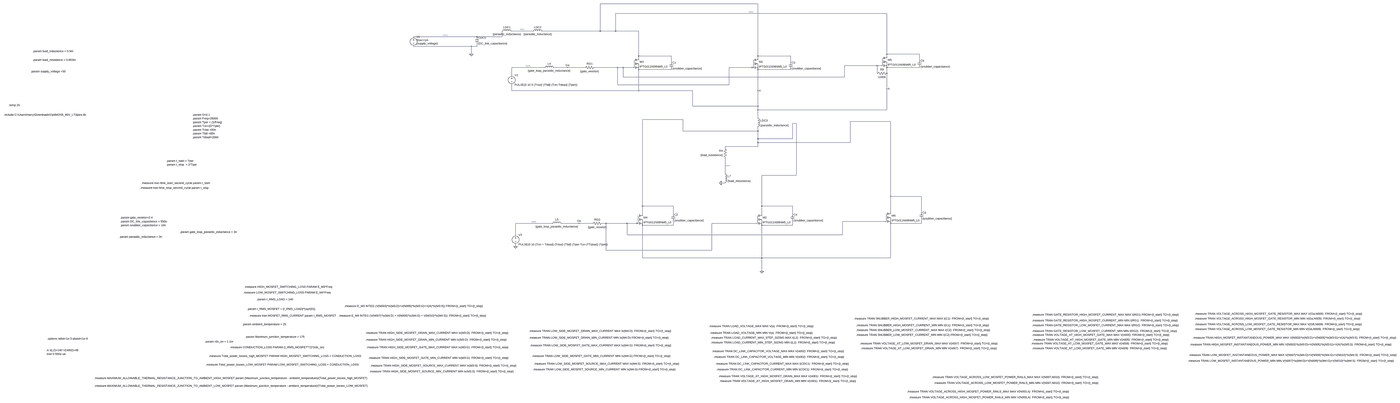
[diagram p0: schematic LTspice_simulation_ready_140A_load_steady_state.asc, whole sheet]
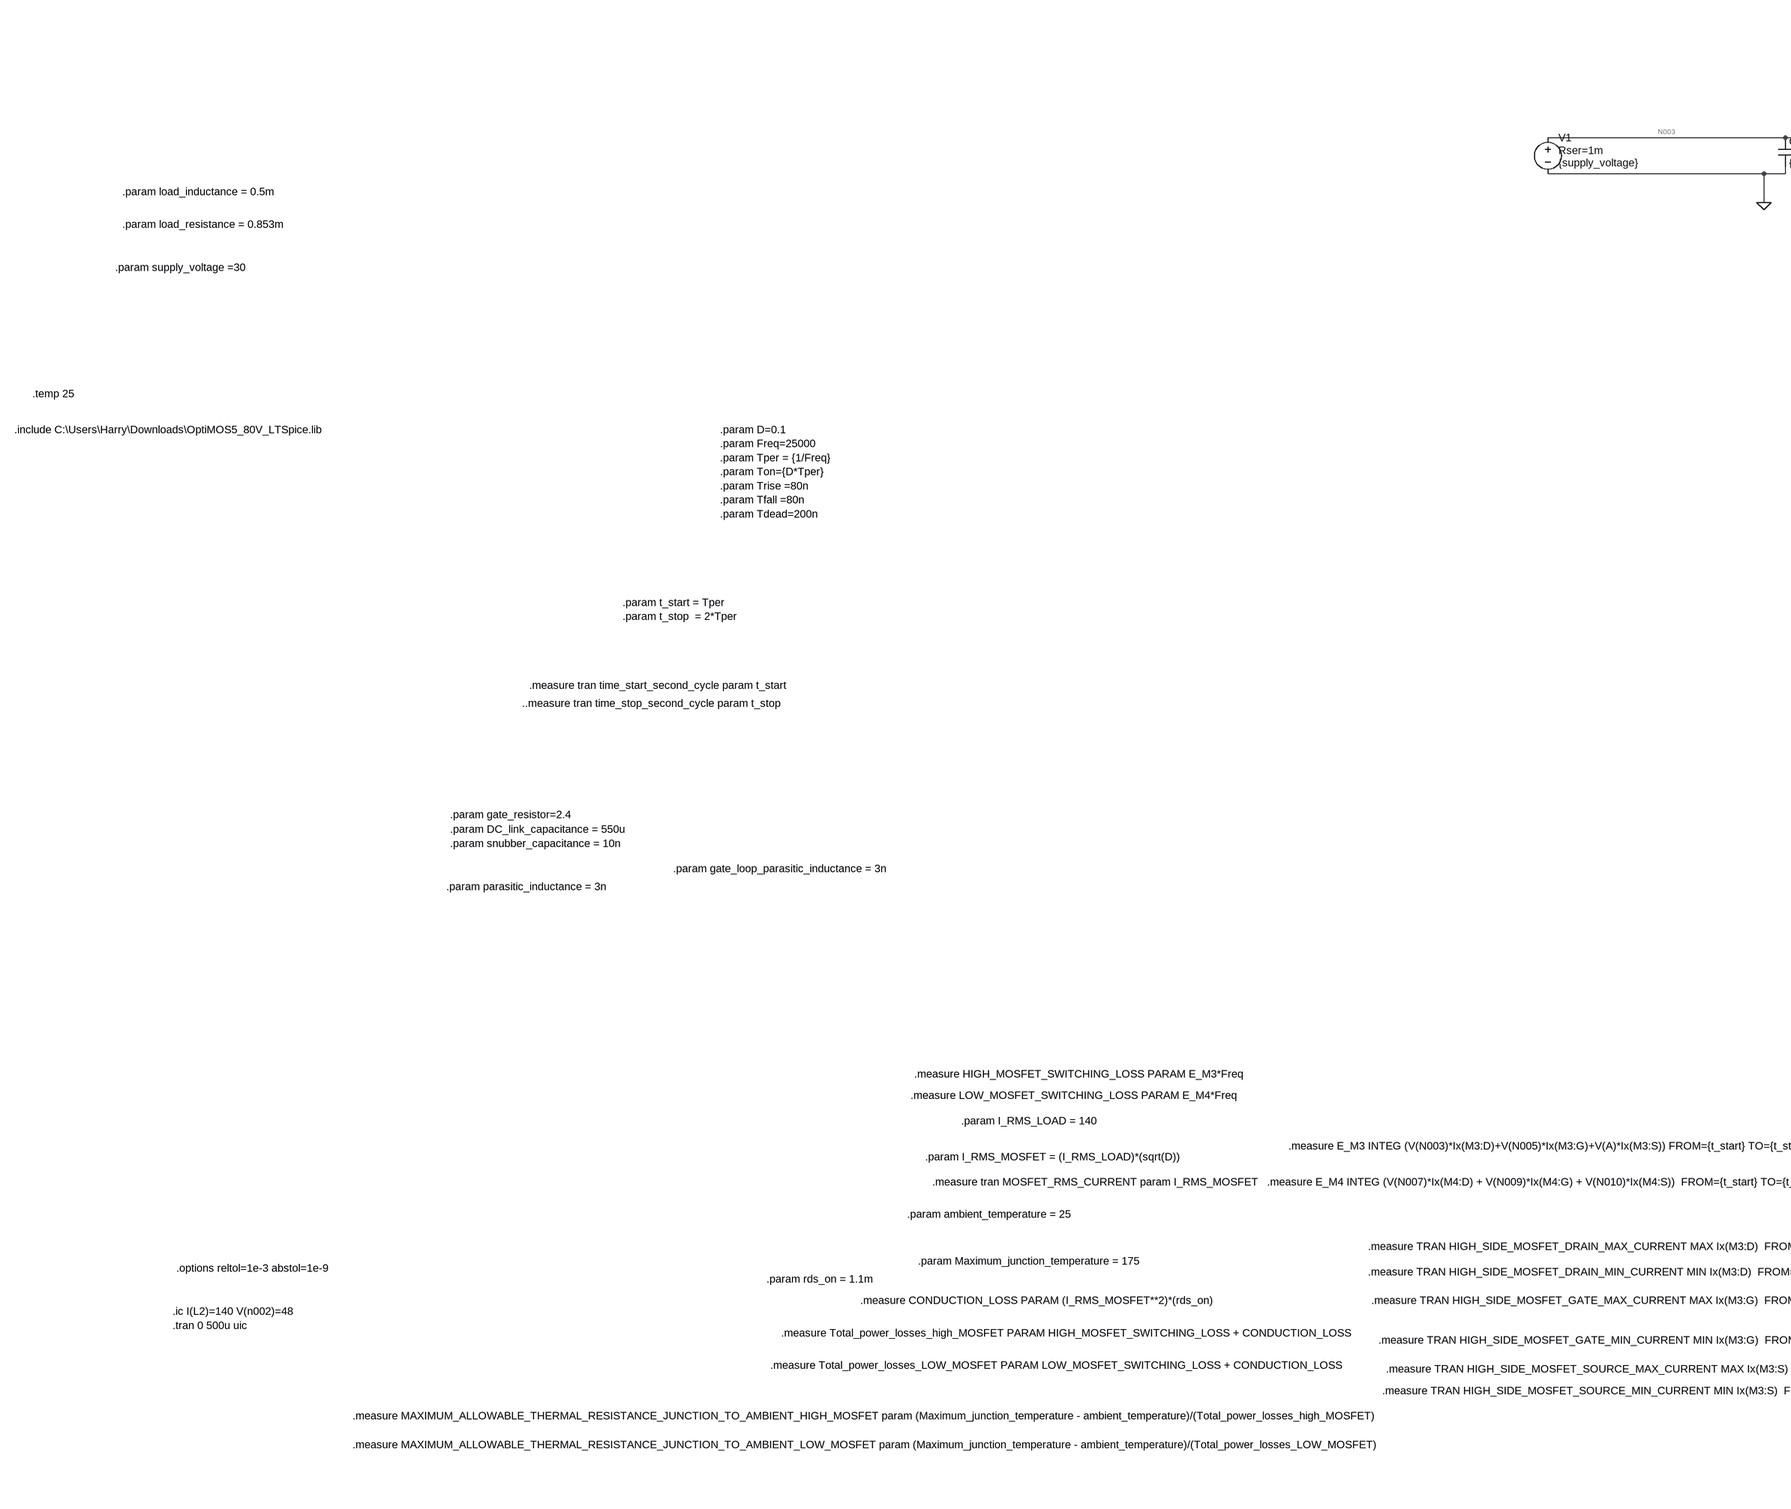
[diagram p1: schematic LTspice_simulation_ready_140A_load_steady_state.asc, part, row 1 of 1, column 1 of 3]
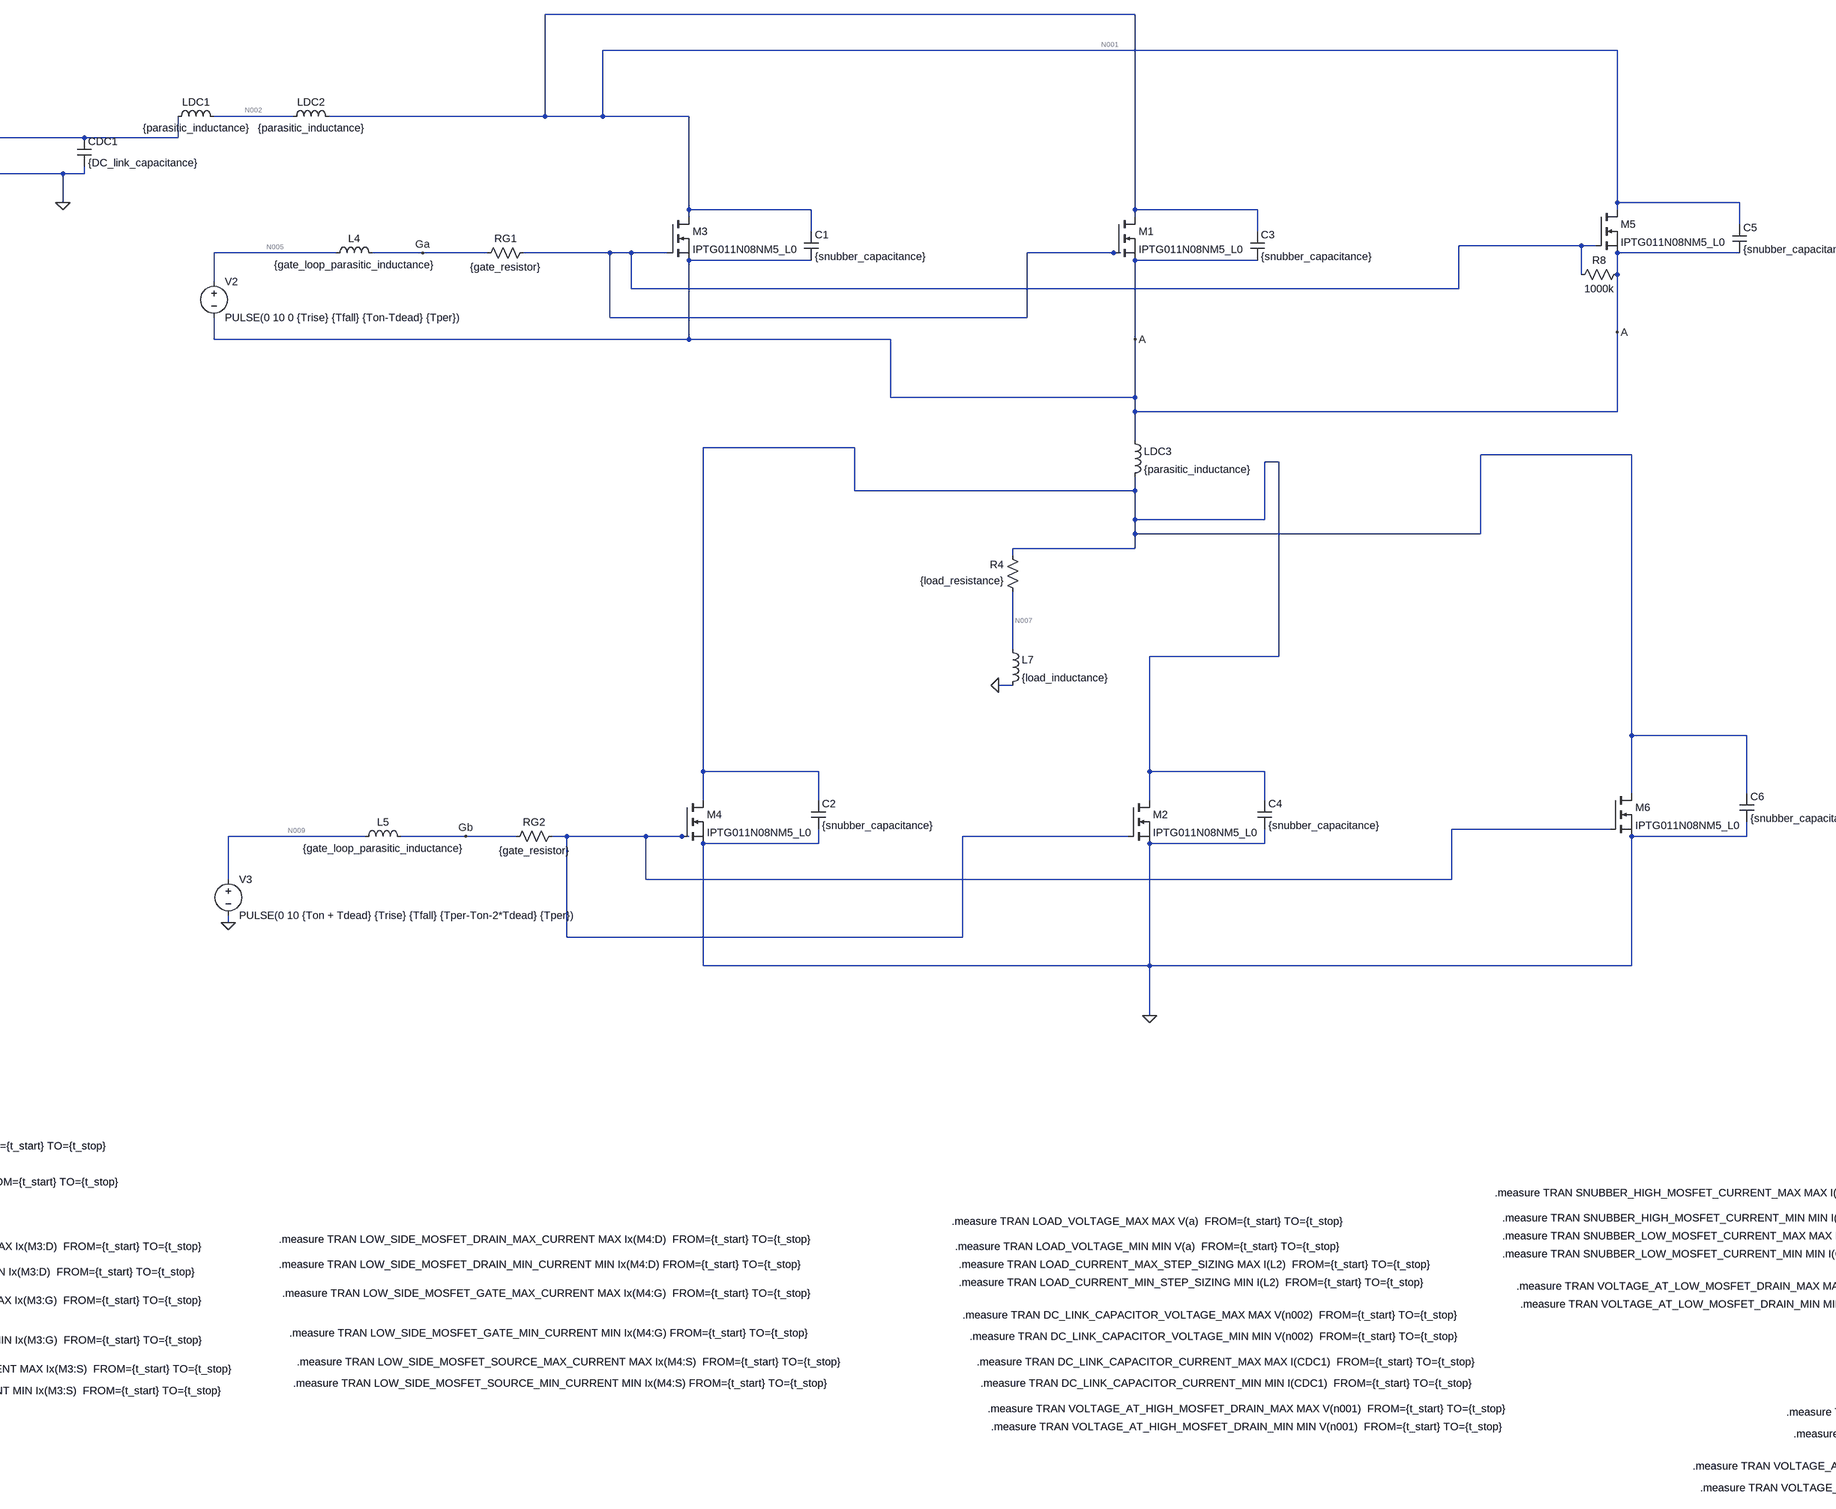
[diagram p2: schematic LTspice_simulation_ready_140A_load_steady_state.asc, part, row 1 of 1, column 2 of 3]
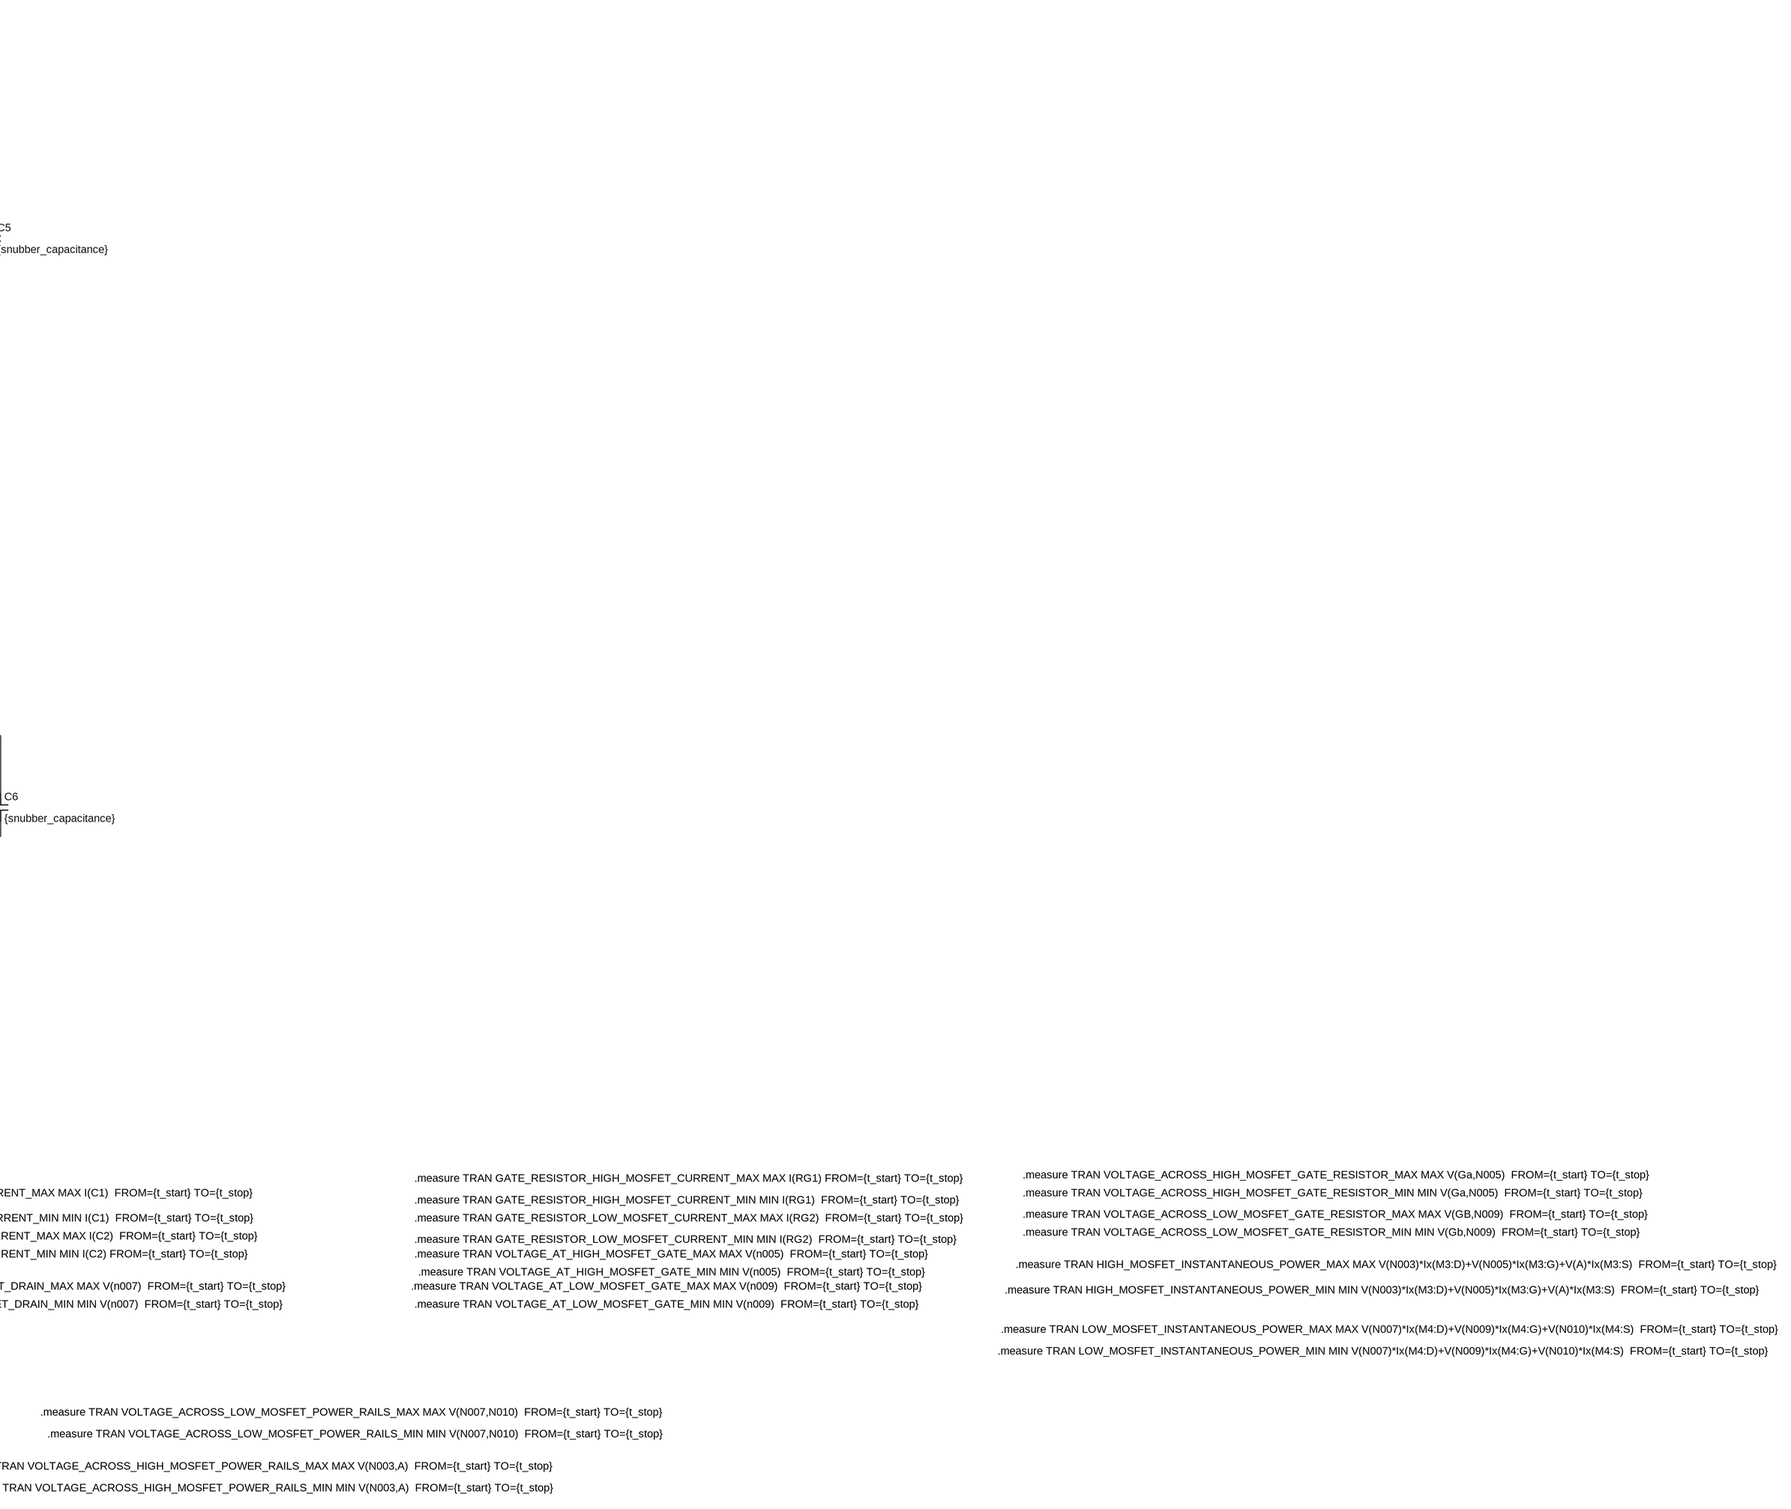
[diagram p3: schematic LTspice_simulation_ready_140A_load_steady_state.asc, part, row 1 of 1, column 3 of 3]
LTspice_simulation_ready_140A_load_steady_state.asc, the LTspice schematic file:
Version 4.1
SHEET 1 7924 1472
WIRE 2480 -2208 1168 -2208
WIRE 3552 -2128 1296 -2128
WIRE 608 -1920 432 -1920
WIRE 1168 -1920 1168 -2208
WIRE 1168 -1920 688 -1920
WIRE 1296 -1920 1296 -2128
WIRE 1296 -1920 1168 -1920
WIRE 1488 -1920 1296 -1920
WIRE 144 -1872 -384 -1872
WIRE 352 -1872 352 -1920
WIRE 352 -1872 144 -1872
WIRE 96 -1792 -384 -1792
WIRE 144 -1792 144 -1808
WIRE 144 -1792 96 -1792
WIRE 96 -1728 96 -1792
WIRE 3552 -1728 3552 -2128
WIRE 3824 -1728 3552 -1728
WIRE 1488 -1712 1488 -1920
WIRE 1760 -1712 1488 -1712
WIRE 2480 -1712 2480 -2208
WIRE 2752 -1712 2480 -1712
WIRE 3552 -1712 3552 -1728
WIRE 1488 -1696 1488 -1712
WIRE 2480 -1696 2480 -1712
WIRE 3824 -1680 3824 -1728
WIRE 1760 -1664 1760 -1712
WIRE 2752 -1664 2752 -1712
WIRE 3472 -1632 3200 -1632
WIRE 3504 -1632 3472 -1632
WIRE 704 -1616 432 -1616
WIRE 896 -1616 784 -1616
WIRE 1040 -1616 896 -1616
WIRE 1312 -1616 1120 -1616
WIRE 1360 -1616 1312 -1616
WIRE 1440 -1616 1360 -1616
WIRE 2432 -1616 2240 -1616
WIRE 2448 -1616 2432 -1616
WIRE 3824 -1616 3552 -1616
WIRE 1760 -1600 1488 -1600
WIRE 2752 -1600 2480 -1600
WIRE 3472 -1568 3472 -1632
WIRE 3552 -1568 3552 -1616
WIRE 432 -1552 432 -1616
WIRE 1360 -1536 1360 -1616
WIRE 3200 -1536 3200 -1632
WIRE 3200 -1536 1360 -1536
WIRE 1312 -1472 1312 -1616
WIRE 2240 -1472 2240 -1616
WIRE 2240 -1472 1312 -1472
WIRE 3552 -1440 3552 -1568
WIRE 432 -1424 432 -1472
WIRE 1488 -1424 1488 -1600
WIRE 1488 -1424 432 -1424
WIRE 1936 -1424 1488 -1424
WIRE 2480 -1424 2480 -1600
WIRE 1936 -1200 1936 -1424
WIRE 2480 -1200 2480 -1424
WIRE 2480 -1200 1936 -1200
WIRE 2480 -1168 2480 -1200
WIRE 3552 -1168 3552 -1440
WIRE 3552 -1168 2480 -1168
WIRE 2480 -1104 2480 -1168
WIRE 1856 -1088 1520 -1088
WIRE 3584 -1072 3248 -1072
WIRE 2800 -1056 2768 -1056
WIRE 1856 -992 1856 -1088
WIRE 2480 -992 2480 -1024
WIRE 2480 -992 1856 -992
WIRE 2480 -928 2480 -992
WIRE 2768 -928 2768 -1056
WIRE 2768 -928 2480 -928
WIRE 2480 -896 2480 -928
WIRE 3248 -896 3248 -1072
WIRE 3248 -896 2480 -896
WIRE 2480 -864 2480 -896
WIRE 2480 -864 2208 -864
WIRE 2208 -848 2208 -864
WIRE 2208 -640 2208 -768
WIRE 2800 -624 2800 -1056
WIRE 2800 -624 2512 -624
WIRE 2208 -560 2176 -560
WIRE 3584 -448 3584 -1072
WIRE 3840 -448 3584 -448
WIRE 1520 -368 1520 -1088
WIRE 1776 -368 1520 -368
WIRE 2512 -368 2512 -624
WIRE 2768 -368 2512 -368
WIRE 3584 -320 3584 -448
WIRE 3840 -320 3840 -448
WIRE 1520 -304 1520 -368
WIRE 1776 -304 1776 -368
WIRE 2512 -304 2512 -368
WIRE 2768 -304 2768 -368
WIRE 3536 -240 3184 -240
WIRE 768 -224 464 -224
WIRE 992 -224 848 -224
WIRE 1104 -224 992 -224
WIRE 1216 -224 1184 -224
WIRE 1392 -224 1216 -224
WIRE 1472 -224 1392 -224
WIRE 1488 -224 1472 -224
WIRE 2464 -224 2096 -224
WIRE 3840 -224 3840 -256
WIRE 3840 -224 3584 -224
WIRE 1776 -208 1776 -240
WIRE 1776 -208 1520 -208
WIRE 2512 -208 2512 -224
WIRE 2768 -208 2768 -240
WIRE 2768 -208 2512 -208
WIRE 464 -128 464 -224
WIRE 1392 -128 1392 -224
WIRE 3184 -128 3184 -240
WIRE 3184 -128 1392 -128
WIRE 464 -32 464 -48
WIRE 1216 0 1216 -224
WIRE 2096 0 2096 -224
WIRE 2096 0 1216 0
WIRE 1520 64 1520 -208
WIRE 2512 64 2512 -208
WIRE 2512 64 1520 64
WIRE 3584 64 3584 -224
WIRE 3584 64 2512 64
WIRE 2512 256 2512 64
FLAG 896 -1616 Ga
FLAG 992 -224 Gb
FLAG 96 -1728 0
FLAG 464 -32 0
FLAG 2176 -560 0
FLAG 2480 -1424 A
FLAG 3552 -1440 A
FLAG 2512 256 0
SYMBOL voltage -384 -1888 R0
WINDOW 123 0 0 Left 0
WINDOW 39 24 44 Left 2
WINDOW 3 24 72 Left 2
SYMATTR SpiceLine Rser=1m
SYMATTR Value {supply_voltage}
SYMATTR InstName V1
SYMBOL cap 128 -1872 R0
SYMATTR InstName CDC1
SYMATTR Value {DC_link_capacitance}
SYMATTR SpiceLine Rser=1m
SYMBOL ind 336 -1904 R270
WINDOW 0 32 56 VTop 2
WINDOW 3 5 56 VBottom 2
SYMATTR InstName LDC1
SYMATTR Value {parasitic_inductance}
SYMATTR SpiceLine Rser=1m
SYMBOL res 1136 -1632 R90
WINDOW 0 0 56 VBottom 2
WINDOW 3 32 56 VTop 2
SYMATTR InstName RG1
SYMATTR Value {gate_resistor}
SYMBOL res 1200 -240 R90
WINDOW 0 0 56 VBottom 2
WINDOW 3 32 56 VTop 2
SYMATTR InstName RG2
SYMATTR Value {gate_resistor}
SYMBOL voltage 432 -1568 R0
WINDOW 123 0 0 Left 0
WINDOW 39 0 0 Left 0
SYMATTR InstName V2
SYMATTR Value PULSE(0 10 0 {Trise} {Tfall} {Ton-Tdead} {Tper})
SYMBOL voltage 464 -144 R0
WINDOW 123 0 0 Left 0
WINDOW 39 0 0 Left 0
SYMATTR InstName V3
SYMATTR Value PULSE(0 10 {Ton + Tdead} {Trise} {Tfall} {Tper-Ton-2*Tdead} {Tper})
SYMBOL ind 688 -1600 R270
WINDOW 0 32 56 VTop 2
WINDOW 3 5 56 VBottom 2
SYMATTR InstName L4
SYMATTR Value {gate_loop_parasitic_inductance}
SYMATTR SpiceLine Rser=1m
SYMBOL ind 752 -208 R270
WINDOW 0 32 56 VTop 2
WINDOW 3 5 56 VBottom 2
SYMATTR InstName L5
SYMATTR Value {gate_loop_parasitic_inductance}
SYMATTR SpiceLine Rser=1m
SYMBOL cap 1744 -1664 R0
SYMATTR InstName C1
SYMATTR Value {snubber_capacitance}
SYMBOL cap 1760 -304 R0
SYMATTR InstName C2
SYMATTR Value {snubber_capacitance}
SYMBOL nmos 1440 -1696 R0
SYMATTR InstName M3
SYMATTR Value IPTG011N08NM5_L0
SYMATTR Prefix X
SYMBOL nmos 1472 -304 R0
SYMATTR InstName M4
SYMATTR Value IPTG011N08NM5_L0
SYMATTR Prefix X
SYMBOL res 2224 -752 R180
WINDOW 0 36 76 Left 2
WINDOW 3 36 40 Left 2
SYMATTR InstName R4
SYMATTR Value {load_resistance}
SYMBOL ind 2192 -656 R0
SYMATTR InstName L7
SYMATTR Value {load_inductance}
SYMATTR SpiceLine Rser=1m
SYMBOL cap 2736 -1664 R0
SYMATTR InstName C3
SYMATTR Value {snubber_capacitance}
SYMBOL cap 2752 -304 R0
SYMATTR InstName C4
SYMATTR Value {snubber_capacitance}
SYMBOL nmos 2432 -1696 R0
SYMATTR InstName M1
SYMATTR Value IPTG011N08NM5_L0
SYMATTR Prefix X
SYMBOL nmos 2464 -304 R0
SYMATTR InstName M2
SYMATTR Value IPTG011N08NM5_L0
SYMATTR Prefix X
SYMBOL res 3568 -1584 R90
WINDOW 0 0 56 VBottom 2
WINDOW 3 32 56 VTop 2
SYMATTR InstName R8
SYMATTR Value 1000k
SYMBOL cap 3808 -1680 R0
SYMATTR InstName C5
SYMATTR Value {snubber_capacitance}
SYMBOL cap 3824 -320 R0
SYMATTR InstName C6
SYMATTR Value {snubber_capacitance}
SYMBOL nmos 3504 -1712 R0
SYMATTR InstName M5
SYMATTR Value IPTG011N08NM5_L0
SYMATTR Prefix X
SYMBOL nmos 3536 -320 R0
SYMATTR InstName M6
SYMATTR Value IPTG011N08NM5_L0
SYMATTR Prefix X
SYMBOL ind 592 -1904 R270
WINDOW 0 32 56 VTop 2
WINDOW 3 5 56 VBottom 2
SYMATTR InstName LDC2
SYMATTR Value {parasitic_inductance}
SYMATTR SpiceLine Rser=1m
SYMBOL ind 2464 -1120 R0
SYMATTR InstName LDC3
SYMATTR Value {parasitic_inductance}
SYMATTR SpiceLine Rser=1m
TEXT -2224 -1128 Left 2 !.param D=0.1\n.param Freq=25000\n.param Tper = {1/Freq}\n.param Ton={D*Tper}\n.param Trise =80n\n.param Tfall =80n\n.param Tdead=200n
TEXT -3432 968 Left 2 !.options reltol=1e-3 abstol=1e-9
TEXT -3792 -1128 Left 2 !.include C:\\Users\\Harry\\Downloads\\OptiMOS5_80V_LTSpice.lib
TEXT -3752 -1208 Left 2 !.temp 25
TEXT -2824 -208 Left 2 !.param snubber_capacitance = 10n
TEXT -2824 -240 Left 2 !.param DC_link_capacitance = 550u
TEXT -2824 -272 Left 2 !.param gate_resistor=2.4
TEXT -3568 -1584 Left 2 !.param supply_voltage =30
TEXT -3552 -1680 Left 2 !.param load_resistance = 0.853m
TEXT -3552 -1752 Left 2 !.param load_inductance = 0.5m
TEXT -2832 -112 Left 2 !.param parasitic_inductance = 3n
TEXT -960 696 Left 2 !.measure E_M3 INTEG (V(N003)*Ix(M3:D)+V(N005)*Ix(M3:G)+V(A)*Ix(M3:S)) FROM={t_start} TO={t_stop}
TEXT -1008 776 Left 2 !.measure E_M4 INTEG (V(N007)*Ix(M4:D) + V(N009)*Ix(M4:G) + V(N010)*Ix(M4:S))  FROM={t_start} TO={t_stop}
TEXT -784 920 Left 2 !.measure TRAN HIGH_SIDE_MOSFET_DRAIN_MAX_CURRENT MAX Ix(M3:D)  FROM={t_start} TO={t_stop}
TEXT -784 976 Left 2 !.measure TRAN HIGH_SIDE_MOSFET_DRAIN_MIN_CURRENT MIN Ix(M3:D)  FROM={t_start} TO={t_stop}
TEXT -776 1040 Left 2 !.measure TRAN HIGH_SIDE_MOSFET_GATE_MAX_CURRENT MAX Ix(M3:G)  FROM={t_start} TO={t_stop}
TEXT -760 1128 Left 2 !.measure TRAN HIGH_SIDE_MOSFET_GATE_MIN_CURRENT MIN Ix(M3:G)  FROM={t_start} TO={t_stop}
TEXT -752 1240 Left 2 !.measure TRAN HIGH_SIDE_MOSFET_SOURCE_MIN_CURRENT MIN Ix(M3:S)  FROM={t_start} TO={t_stop}
TEXT -744 1192 Left 2 !.measure TRAN HIGH_SIDE_MOSFET_SOURCE_MAX_CURRENT MAX Ix(M3:S)  FROM={t_start} TO={t_stop}
TEXT 576 904 Left 2 !.measure TRAN LOW_SIDE_MOSFET_DRAIN_MAX_CURRENT MAX Ix(M4:D)  FROM={t_start} TO={t_stop}
TEXT 576 960 Left 2 !.measure TRAN LOW_SIDE_MOSFET_DRAIN_MIN_CURRENT MIN Ix(M4:D) FROM={t_start} TO={t_stop}
TEXT 584 1024 Left 2 !.measure TRAN LOW_SIDE_MOSFET_GATE_MAX_CURRENT MAX Ix(M4:G)  FROM={t_start} TO={t_stop}
TEXT 600 1112 Left 2 !.measure TRAN LOW_SIDE_MOSFET_GATE_MIN_CURRENT MIN Ix(M4:G) FROM={t_start} TO={t_stop}
TEXT 608 1224 Left 2 !.measure TRAN LOW_SIDE_MOSFET_SOURCE_MIN_CURRENT MIN Ix(M4:S) FROM={t_start} TO={t_stop}
TEXT 616 1176 Left 2 !.measure TRAN LOW_SIDE_MOSFET_SOURCE_MAX_CURRENT MAX Ix(M4:S)  FROM={t_start} TO={t_stop}
TEXT 2072 864 Left 2 !.measure TRAN LOAD_VOLTAGE_MAX MAX V(a)  FROM={t_start} TO={t_stop}
TEXT 2080 920 Left 2 !.measure TRAN LOAD_VOLTAGE_MIN MIN V(a)  FROM={t_start} TO={t_stop}
TEXT 2088 960 Left 2 !.measure TRAN LOAD_CURRENT_MAX_STEP_SIZING MAX I(L2)  FROM={t_start} TO={t_stop}
TEXT 2088 1000 Left 2 !.measure TRAN LOAD_CURRENT_MIN_STEP_SIZING MIN I(L2)  FROM={t_start} TO={t_stop}
TEXT 2096 1072 Left 2 !.measure TRAN DC_LINK_CAPACITOR_VOLTAGE_MAX MAX V(n002)  FROM={t_start} TO={t_stop}
TEXT 2112 1120 Left 2 !.measure TRAN DC_LINK_CAPACITOR_VOLTAGE_MIN MIN V(n002)  FROM={t_start} TO={t_stop}
TEXT 2128 1176 Left 2 !.measure TRAN DC_LINK_CAPACITOR_CURRENT_MAX MAX I(CDC1)  FROM={t_start} TO={t_stop}
TEXT 2136 1224 Left 2 !.measure TRAN DC_LINK_CAPACITOR_CURRENT_MIN MIN I(CDC1)  FROM={t_start} TO={t_stop}
TEXT 2152 1280 Left 2 !.measure TRAN VOLTAGE_AT_HIGH_MOSFET_DRAIN_MAX MAX V(n001)  FROM={t_start} TO={t_stop}
TEXT 2160 1320 Left 2 !.measure TRAN VOLTAGE_AT_HIGH_MOSFET_DRAIN_MIN MIN V(n001)  FROM={t_start} TO={t_stop}
TEXT 3280 800 Left 2 !.measure TRAN SNUBBER_HIGH_MOSFET_CURRENT_MAX MAX I(C1)  FROM={t_start} TO={t_stop}
TEXT 3296 856 Left 2 !.measure TRAN SNUBBER_HIGH_MOSFET_CURRENT_MIN MIN I(C1)  FROM={t_start} TO={t_stop}
TEXT 3296 896 Left 2 !.measure TRAN SNUBBER_LOW_MOSFET_CURRENT_MAX MAX I(C2)  FROM={t_start} TO={t_stop}
TEXT 3296 936 Left 2 !.measure TRAN SNUBBER_LOW_MOSFET_CURRENT_MIN MIN I(C2) FROM={t_start} TO={t_stop}
TEXT 3328 1008 Left 2 !.measure TRAN VOLTAGE_AT_LOW_MOSFET_DRAIN_MAX MAX V(n007)  FROM={t_start} TO={t_stop}
TEXT 3336 1048 Left 2 !.measure TRAN VOLTAGE_AT_LOW_MOSFET_DRAIN_MIN MIN V(n007)  FROM={t_start} TO={t_stop}
TEXT 4760 768 Left 2 !.measure TRAN GATE_RESISTOR_HIGH_MOSFET_CURRENT_MAX MAX I(RG1) FROM={t_start} TO={t_stop}
TEXT 4760 816 Left 2 !.measure TRAN GATE_RESISTOR_HIGH_MOSFET_CURRENT_MIN MIN I(RG1)  FROM={t_start} TO={t_stop}
TEXT 4760 856 Left 2 !.measure TRAN GATE_RESISTOR_LOW_MOSFET_CURRENT_MAX MAX I(RG2)  FROM={t_start} TO={t_stop}
TEXT 4760 904 Left 2 !.measure TRAN GATE_RESISTOR_LOW_MOSFET_CURRENT_MIN MIN I(RG2)  FROM={t_start} TO={t_stop}
TEXT 4760 936 Left 2 !.measure TRAN VOLTAGE_AT_HIGH_MOSFET_GATE_MAX MAX V(n005)  FROM={t_start} TO={t_stop}
TEXT 4768 976 Left 2 !.measure TRAN VOLTAGE_AT_HIGH_MOSFET_GATE_MIN MIN V(n005)  FROM={t_start} TO={t_stop}
TEXT 4752 1008 Left 2 !.measure TRAN VOLTAGE_AT_LOW_MOSFET_GATE_MAX MAX V(n009)  FROM={t_start} TO={t_stop}
TEXT 4760 1048 Left 2 !.measure TRAN VOLTAGE_AT_LOW_MOSFET_GATE_MIN MIN V(n009)  FROM={t_start} TO={t_stop}
TEXT 6112 760 Left 2 !.measure TRAN VOLTAGE_ACROSS_HIGH_MOSFET_GATE_RESISTOR_MAX MAX V(Ga,N005)  FROM={t_start} TO={t_stop}
TEXT 6112 800 Left 2 !.measure TRAN VOLTAGE_ACROSS_HIGH_MOSFET_GATE_RESISTOR_MIN MIN V(Ga,N005)  FROM={t_start} TO={t_stop}
TEXT 6112 848 Left 2 !.measure TRAN VOLTAGE_ACROSS_LOW_MOSFET_GATE_RESISTOR_MAX MAX V(GB,N009)  FROM={t_start} TO={t_stop}
TEXT 6112 888 Left 2 !.measure TRAN VOLTAGE_ACROSS_LOW_MOSFET_GATE_RESISTOR_MIN MIN V(Gb,N009)  FROM={t_start} TO={t_stop}
TEXT 6096 960 Left 2 !.measure TRAN HIGH_MOSFET_INSTANTANEOUS_POWER_MAX MAX V(N003)*Ix(M3:D)+V(N005)*Ix(M3:G)+V(A)*Ix(M3:S)  FROM={t_start} TO={t_stop}
TEXT 6072 1016 Left 2 !.measure TRAN HIGH_MOSFET_INSTANTANEOUS_POWER_MIN MIN V(N003)*Ix(M3:D)+V(N005)*Ix(M3:G)+V(A)*Ix(M3:S)  FROM={t_start} TO={t_stop}
TEXT 6064 1104 Left 2 !.measure TRAN LOW_MOSFET_INSTANTANEOUS_POWER_MAX MAX V(N007)*Ix(M4:D)+V(N009)*Ix(M4:G)+V(N010)*Ix(M4:S)  FROM={t_start} TO={t_stop}
TEXT 6056 1152 Left 2 !.measure TRAN LOW_MOSFET_INSTANTANEOUS_POWER_MIN MIN V(N007)*Ix(M4:D)+V(N009)*Ix(M4:G)+V(N010)*Ix(M4:S)  FROM={t_start} TO={t_stop}
TEXT -2328 -152 Left 2 !.param gate_loop_parasitic_inductance = 3n
TEXT -2440 -744 Left 2 !.param t_start = Tper\n.param t_stop  = 2*Tper
TEXT -2648 -560 Left 2 !.measure tran time_start_second_cycle param t_start
TEXT -2664 -520 Left 2 !..measure tran time_stop_second_cycle param t_stop
TEXT -1792 536 Left 2 !.measure HIGH_MOSFET_SWITCHING_LOSS PARAM E_M3*Freq
TEXT -1800 584 Left 2 !.measure LOW_MOSFET_SWITCHING_LOSS PARAM E_M4*Freq
TEXT -1688 640 Left 2 !.param I_RMS_LOAD = 140
TEXT -1768 720 Left 2 !.param I_RMS_MOSFET = (I_RMS_LOAD)*(sqrt(D))
TEXT -1752 776 Left 2 !.measure tran MOSFET_RMS_CURRENT param I_RMS_MOSFET
TEXT -1808 848 Left 2 !.param ambient_temperature = 25
TEXT -1784 952 Left 2 !.param Maximum_junction_temperature = 175
TEXT -2088 1112 Left 2 !.measure Total_power_losses_high_MOSFET PARAM HIGH_MOSFET_SWITCHING_LOSS + CONDUCTION_LOSS
TEXT -1912 1040 Left 2 !.measure CONDUCTION_LOSS PARAM (I_RMS_MOSFET**2)*(rds_on)
TEXT -2120 992 Left 2 !.param rds_on = 1.1m
TEXT -2112 1184 Left 2 !.measure Total_power_losses_LOW_MOSFET PARAM LOW_MOSFET_SWITCHING_LOSS + CONDUCTION_LOSS
TEXT -3040 1296 Left 2 !.measure MAXIMUM_ALLOWABLE_THERMAL_RESISTANCE_JUNCTION_TO_AMBIENT_HIGH_MOSFET param (Maximum_junction_temperature - ambient_temperature)/(Total_power_losses_high_MOSFET)
TEXT -3040 1360 Left 2 !.measure MAXIMUM_ALLOWABLE_THERMAL_RESISTANCE_JUNCTION_TO_AMBIENT_LOW_MOSFET param (Maximum_junction_temperature - ambient_temperature)/(Total_power_losses_LOW_MOSFET)
TEXT -3440 1064 Left 2 !.ic I(L2)=140 V(n002)=48\n.tran 0 500u uic
TEXT 3720 1408 Left 2 !.measure TRAN VOLTAGE_ACROSS_HIGH_MOSFET_POWER_RAILS_MAX MAX V(N003,A)  FROM={t_start} TO={t_stop}
TEXT 3736 1456 Left 2 !.measure TRAN VOLTAGE_ACROSS_HIGH_MOSFET_POWER_RAILS_MIN MIN V(N003,A)  FROM={t_start} TO={t_stop}
TEXT 3928 1288 Left 2 !.measure TRAN VOLTAGE_ACROSS_LOW_MOSFET_POWER_RAILS_MAX MAX V(N007,N010)  FROM={t_start} TO={t_stop}
TEXT 3944 1336 Left 2 !.measure TRAN VOLTAGE_ACROSS_LOW_MOSFET_POWER_RAILS_MIN MIN V(N007,N010)  FROM={t_start} TO={t_stop}

The netlist it stands for:
* LTspice_simulation_ready_140A_load_steady_state.asc
V1 N003 0 {supply_voltage} Rser=1m
CDC1 N003 0 {DC_link_capacitance} Rser=1m
LDC1 N003 N002 {parasitic_inductance} Rser=1m
RG1 N004 Ga {gate_resistor}
RG2 N008 Gb {gate_resistor}
V2 N005 A PULSE(0 10 0 {Trise} {Tfall} {Ton-Tdead} {Tper})
V3 N009 0 PULSE(0 10 {Ton + Tdead} {Trise} {Tfall} {Tper-Ton-2*Tdead} {Tper})
L4 N005 Ga {gate_loop_parasitic_inductance} Rser=1m
L5 N009 Gb {gate_loop_parasitic_inductance} Rser=1m
C1 N001 A {snubber_capacitance}
C2 N006 0 {snubber_capacitance}
X§M3 N001 N004 A IPTG011N08NM5_L0  ; pins D G S
X§M4 N006 N008 0 IPTG011N08NM5_L0  ; pins D G S
R4 N007 N006 {load_resistance}
L7 N007 0 {load_inductance} Rser=1m
C3 N001 A {snubber_capacitance}
C4 N006 0 {snubber_capacitance}
X§M1 N001 N004 A IPTG011N08NM5_L0  ; pins D G S
X§M2 N006 N008 0 IPTG011N08NM5_L0  ; pins D G S
R8 A N004 1000k
C5 N001 A {snubber_capacitance}
C6 N006 0 {snubber_capacitance}
X§M5 N001 N004 A IPTG011N08NM5_L0  ; pins D G S
X§M6 N006 N008 0 IPTG011N08NM5_L0  ; pins D G S
LDC2 N002 N001 {parasitic_inductance} Rser=1m
LDC3 A N006 {parasitic_inductance} Rser=1m
.param D=0.1
.param Freq=25000
.param Tper = {1/Freq}
.param Ton={D*Tper}
.param Trise =80n
.param Tfall =80n
.param Tdead=200n
.options reltol=1e-3 abstol=1e-9
.include C:\Users\Harry\Downloads\OptiMOS5_80V_LTSpice.lib
.temp 25
.param snubber_capacitance = 10n
.param DC_link_capacitance = 550u
.param gate_resistor=2.4
.param supply_voltage =30
.param load_resistance = 0.853m
.param load_inductance = 0.5m
.param parasitic_inductance = 3n
.measure E_M3 INTEG (V(N003)*Ix(M3:D)+V(N005)*Ix(M3:G)+V(A)*Ix(M3:S)) FROM={t_start} TO={t_stop}
.measure E_M4 INTEG (V(N007)*Ix(M4:D) + V(N009)*Ix(M4:G) + V(N010)*Ix(M4:S))  FROM={t_start} TO={t_stop}
.measure TRAN HIGH_SIDE_MOSFET_DRAIN_MAX_CURRENT MAX Ix(M3:D)  FROM={t_start} TO={t_stop}
.measure TRAN HIGH_SIDE_MOSFET_DRAIN_MIN_CURRENT MIN Ix(M3:D)  FROM={t_start} TO={t_stop}
.measure TRAN HIGH_SIDE_MOSFET_GATE_MAX_CURRENT MAX Ix(M3:G)  FROM={t_start} TO={t_stop}
.measure TRAN HIGH_SIDE_MOSFET_GATE_MIN_CURRENT MIN Ix(M3:G)  FROM={t_start} TO={t_stop}
.measure TRAN HIGH_SIDE_MOSFET_SOURCE_MIN_CURRENT MIN Ix(M3:S)  FROM={t_start} TO={t_stop}
.measure TRAN HIGH_SIDE_MOSFET_SOURCE_MAX_CURRENT MAX Ix(M3:S)  FROM={t_start} TO={t_stop}
.measure TRAN LOW_SIDE_MOSFET_DRAIN_MAX_CURRENT MAX Ix(M4:D)  FROM={t_start} TO={t_stop}
.measure TRAN LOW_SIDE_MOSFET_DRAIN_MIN_CURRENT MIN Ix(M4:D) FROM={t_start} TO={t_stop}
.measure TRAN LOW_SIDE_MOSFET_GATE_MAX_CURRENT MAX Ix(M4:G)  FROM={t_start} TO={t_stop}
.measure TRAN LOW_SIDE_MOSFET_GATE_MIN_CURRENT MIN Ix(M4:G) FROM={t_start} TO={t_stop}
.measure TRAN LOW_SIDE_MOSFET_SOURCE_MIN_CURRENT MIN Ix(M4:S) FROM={t_start} TO={t_stop}
.measure TRAN LOW_SIDE_MOSFET_SOURCE_MAX_CURRENT MAX Ix(M4:S)  FROM={t_start} TO={t_stop}
.measure TRAN LOAD_VOLTAGE_MAX MAX V(a)  FROM={t_start} TO={t_stop}
.measure TRAN LOAD_VOLTAGE_MIN MIN V(a)  FROM={t_start} TO={t_stop}
.measure TRAN LOAD_CURRENT_MAX_STEP_SIZING MAX I(L2)  FROM={t_start} TO={t_stop}
.measure TRAN LOAD_CURRENT_MIN_STEP_SIZING MIN I(L2)  FROM={t_start} TO={t_stop}
.measure TRAN DC_LINK_CAPACITOR_VOLTAGE_MAX MAX V(n002)  FROM={t_start} TO={t_stop}
.measure TRAN DC_LINK_CAPACITOR_VOLTAGE_MIN MIN V(n002)  FROM={t_start} TO={t_stop}
.measure TRAN DC_LINK_CAPACITOR_CURRENT_MAX MAX I(CDC1)  FROM={t_start} TO={t_stop}
.measure TRAN DC_LINK_CAPACITOR_CURRENT_MIN MIN I(CDC1)  FROM={t_start} TO={t_stop}
.measure TRAN VOLTAGE_AT_HIGH_MOSFET_DRAIN_MAX MAX V(n001)  FROM={t_start} TO={t_stop}
.measure TRAN VOLTAGE_AT_HIGH_MOSFET_DRAIN_MIN MIN V(n001)  FROM={t_start} TO={t_stop}
.measure TRAN SNUBBER_HIGH_MOSFET_CURRENT_MAX MAX I(C1)  FROM={t_start} TO={t_stop}
.measure TRAN SNUBBER_HIGH_MOSFET_CURRENT_MIN MIN I(C1)  FROM={t_start} TO={t_stop}
.measure TRAN SNUBBER_LOW_MOSFET_CURRENT_MAX MAX I(C2)  FROM={t_start} TO={t_stop}
.measure TRAN SNUBBER_LOW_MOSFET_CURRENT_MIN MIN I(C2) FROM={t_start} TO={t_stop}
.measure TRAN VOLTAGE_AT_LOW_MOSFET_DRAIN_MAX MAX V(n007)  FROM={t_start} TO={t_stop}
.measure TRAN VOLTAGE_AT_LOW_MOSFET_DRAIN_MIN MIN V(n007)  FROM={t_start} TO={t_stop}
.measure TRAN GATE_RESISTOR_HIGH_MOSFET_CURRENT_MAX MAX I(RG1) FROM={t_start} TO={t_stop}
.measure TRAN GATE_RESISTOR_HIGH_MOSFET_CURRENT_MIN MIN I(RG1)  FROM={t_start} TO={t_stop}
.measure TRAN GATE_RESISTOR_LOW_MOSFET_CURRENT_MAX MAX I(RG2)  FROM={t_start} TO={t_stop}
.measure TRAN GATE_RESISTOR_LOW_MOSFET_CURRENT_MIN MIN I(RG2)  FROM={t_start} TO={t_stop}
.measure TRAN VOLTAGE_AT_HIGH_MOSFET_GATE_MAX MAX V(n005)  FROM={t_start} TO={t_stop}
.measure TRAN VOLTAGE_AT_HIGH_MOSFET_GATE_MIN MIN V(n005)  FROM={t_start} TO={t_stop}
.measure TRAN VOLTAGE_AT_LOW_MOSFET_GATE_MAX MAX V(n009)  FROM={t_start} TO={t_stop}
.measure TRAN VOLTAGE_AT_LOW_MOSFET_GATE_MIN MIN V(n009)  FROM={t_start} TO={t_stop}
.measure TRAN VOLTAGE_ACROSS_HIGH_MOSFET_GATE_RESISTOR_MAX MAX V(Ga,N005)  FROM={t_start} TO={t_stop}
.measure TRAN VOLTAGE_ACROSS_HIGH_MOSFET_GATE_RESISTOR_MIN MIN V(Ga,N005)  FROM={t_start} TO={t_stop}
.measure TRAN VOLTAGE_ACROSS_LOW_MOSFET_GATE_RESISTOR_MAX MAX V(GB,N009)  FROM={t_start} TO={t_stop}
.measure TRAN VOLTAGE_ACROSS_LOW_MOSFET_GATE_RESISTOR_MIN MIN V(Gb,N009)  FROM={t_start} TO={t_stop}
.measure TRAN HIGH_MOSFET_INSTANTANEOUS_POWER_MAX MAX V(N003)*Ix(M3:D)+V(N005)*Ix(M3:G)+V(A)*Ix(M3:S)  FROM={t_start} TO={t_stop}
.measure TRAN HIGH_MOSFET_INSTANTANEOUS_POWER_MIN MIN V(N003)*Ix(M3:D)+V(N005)*Ix(M3:G)+V(A)*Ix(M3:S)  FROM={t_start} TO={t_stop}
.measure TRAN LOW_MOSFET_INSTANTANEOUS_POWER_MAX MAX V(N007)*Ix(M4:D)+V(N009)*Ix(M4:G)+V(N010)*Ix(M4:S)  FROM={t_start} TO={t_stop}
.measure TRAN LOW_MOSFET_INSTANTANEOUS_POWER_MIN MIN V(N007)*Ix(M4:D)+V(N009)*Ix(M4:G)+V(N010)*Ix(M4:S)  FROM={t_start} TO={t_stop}
.param gate_loop_parasitic_inductance = 3n
.param t_start = Tper
.param t_stop  = 2*Tper
.measure tran time_start_second_cycle param t_start
..measure tran time_stop_second_cycle param t_stop
.measure HIGH_MOSFET_SWITCHING_LOSS PARAM E_M3*Freq
.measure LOW_MOSFET_SWITCHING_LOSS PARAM E_M4*Freq
.param I_RMS_LOAD = 140
.param I_RMS_MOSFET = (I_RMS_LOAD)*(sqrt(D))
.measure tran MOSFET_RMS_CURRENT param I_RMS_MOSFET
.param ambient_temperature = 25
.param Maximum_junction_temperature = 175
.measure Total_power_losses_high_MOSFET PARAM HIGH_MOSFET_SWITCHING_LOSS + CONDUCTION_LOSS
.measure CONDUCTION_LOSS PARAM (I_RMS_MOSFET**2)*(rds_on)
.param rds_on = 1.1m
.measure Total_power_losses_LOW_MOSFET PARAM LOW_MOSFET_SWITCHING_LOSS + CONDUCTION_LOSS
.measure MAXIMUM_ALLOWABLE_THERMAL_RESISTANCE_JUNCTION_TO_AMBIENT_HIGH_MOSFET param (Maximum_junction_temperature - ambient_temperature)/(Total_power_losses_high_MOSFET)
.measure MAXIMUM_ALLOWABLE_THERMAL_RESISTANCE_JUNCTION_TO_AMBIENT_LOW_MOSFET param (Maximum_junction_temperature - ambient_temperature)/(Total_power_losses_LOW_MOSFET)
.ic I(L2)=140 V(n002)=48
.tran 0 500u uic
.measure TRAN VOLTAGE_ACROSS_HIGH_MOSFET_POWER_RAILS_MAX MAX V(N003,A)  FROM={t_start} TO={t_stop}
.measure TRAN VOLTAGE_ACROSS_HIGH_MOSFET_POWER_RAILS_MIN MIN V(N003,A)  FROM={t_start} TO={t_stop}
.measure TRAN VOLTAGE_ACROSS_LOW_MOSFET_POWER_RAILS_MAX MAX V(N007,N010)  FROM={t_start} TO={t_stop}
.measure TRAN VOLTAGE_ACROSS_LOW_MOSFET_POWER_RAILS_MIN MIN V(N007,N010)  FROM={t_start} TO={t_stop}
.backanno
.end